# Altium project miniFlycontrol_V6_2.PrjPCB
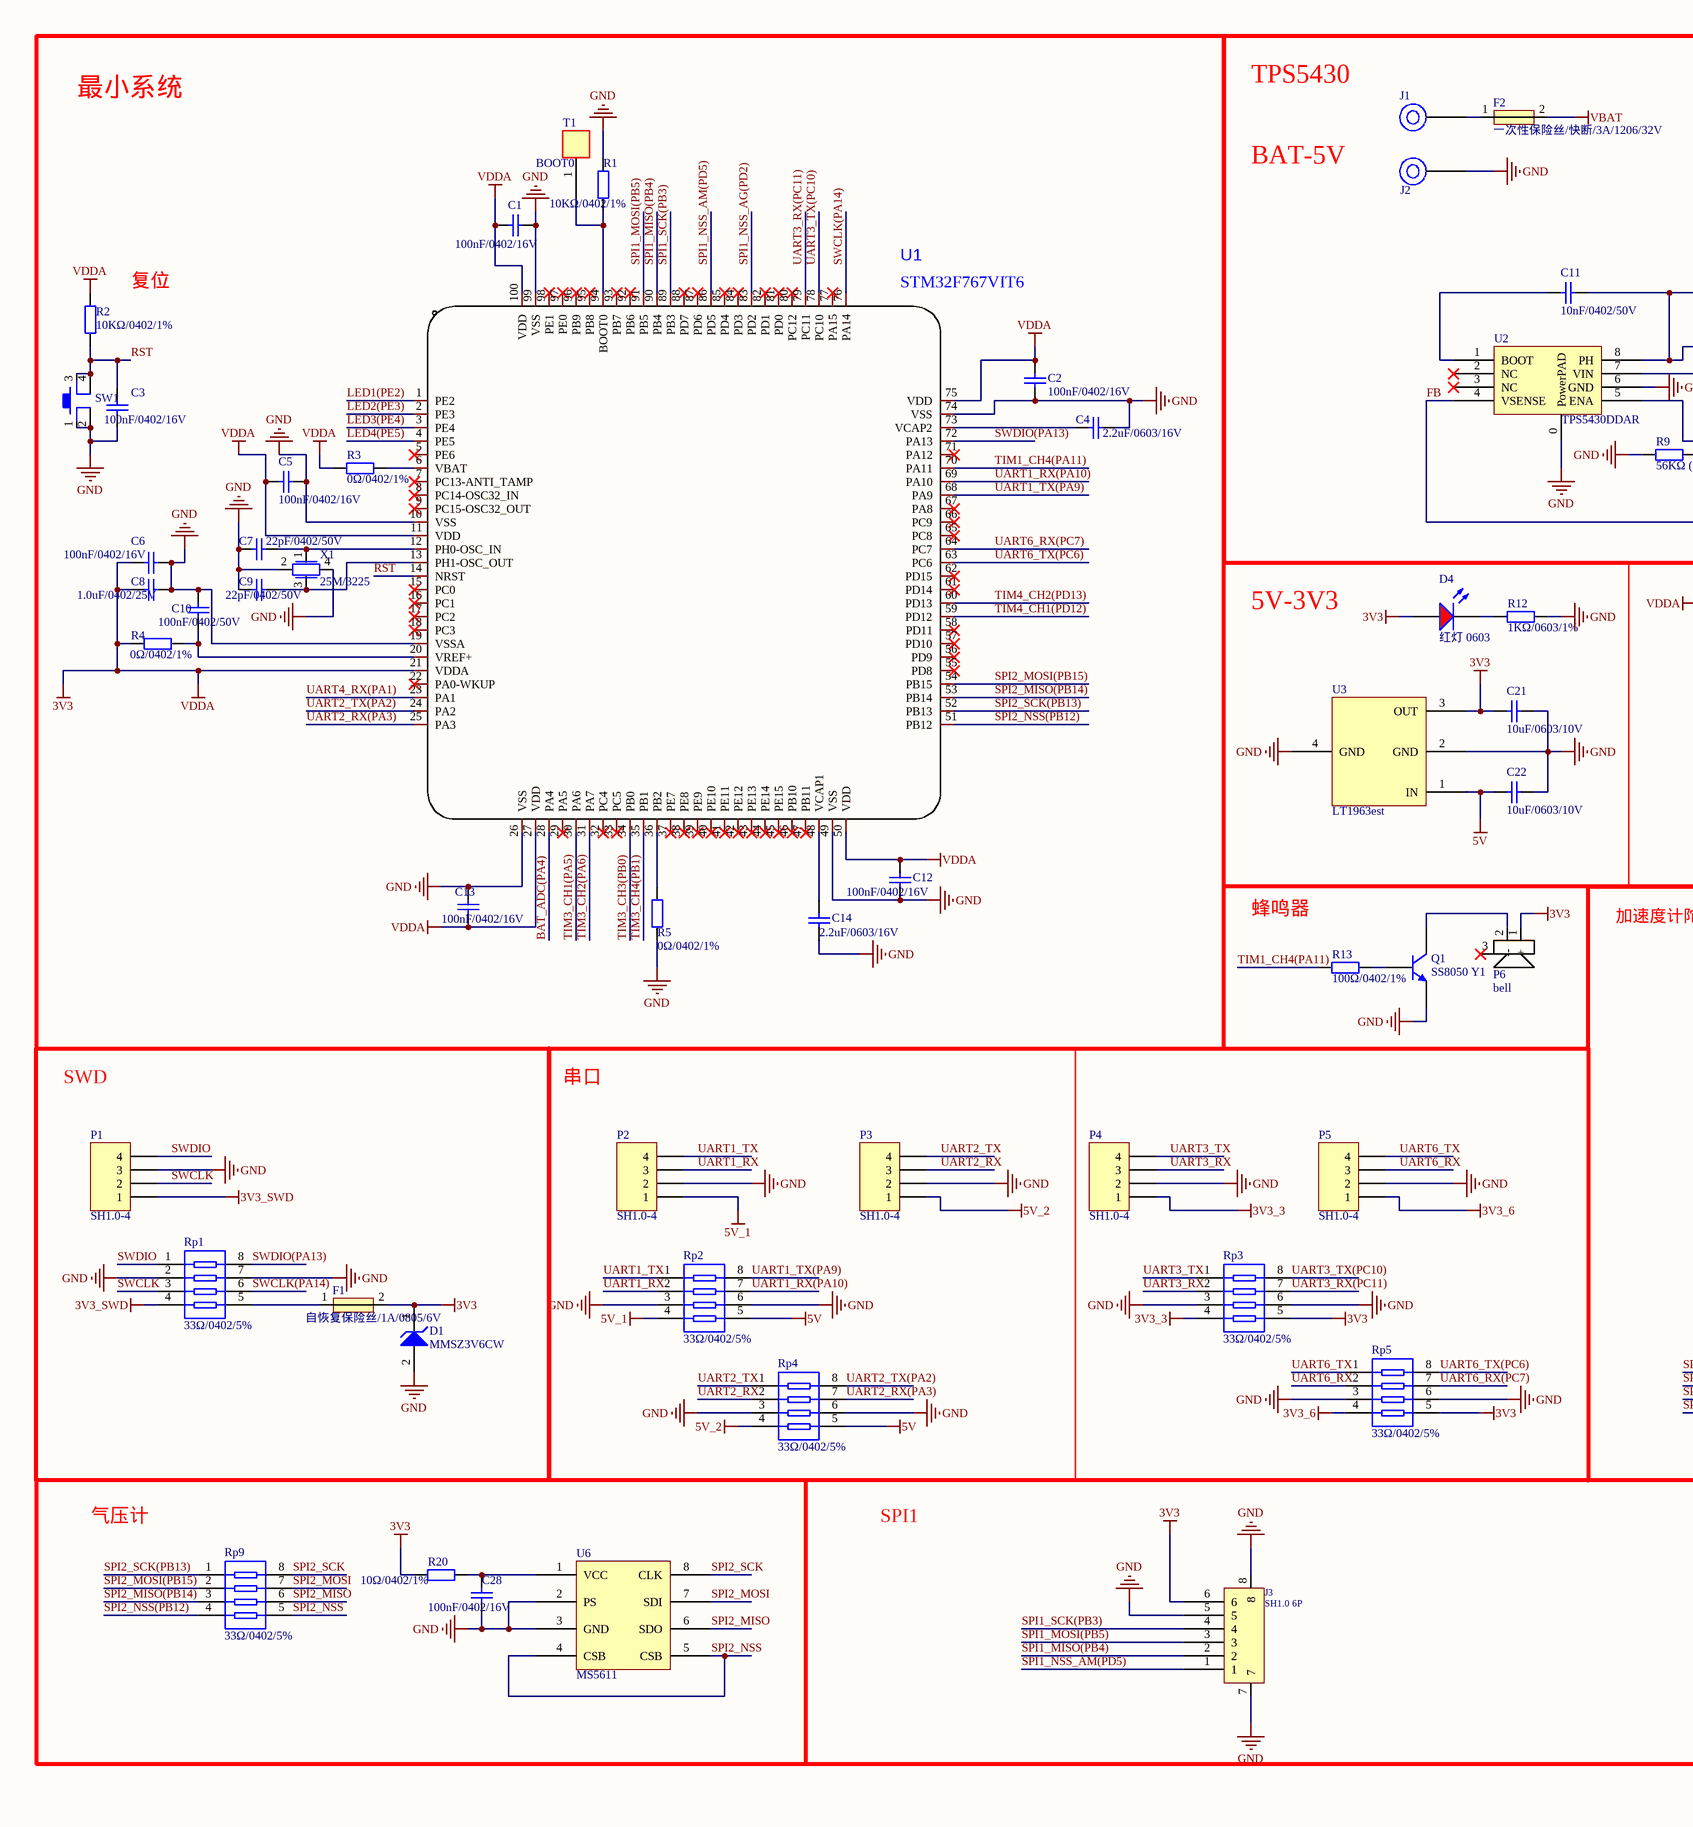
[diagram p0: miniFlycontrol_V6_2.SchDoc, left]
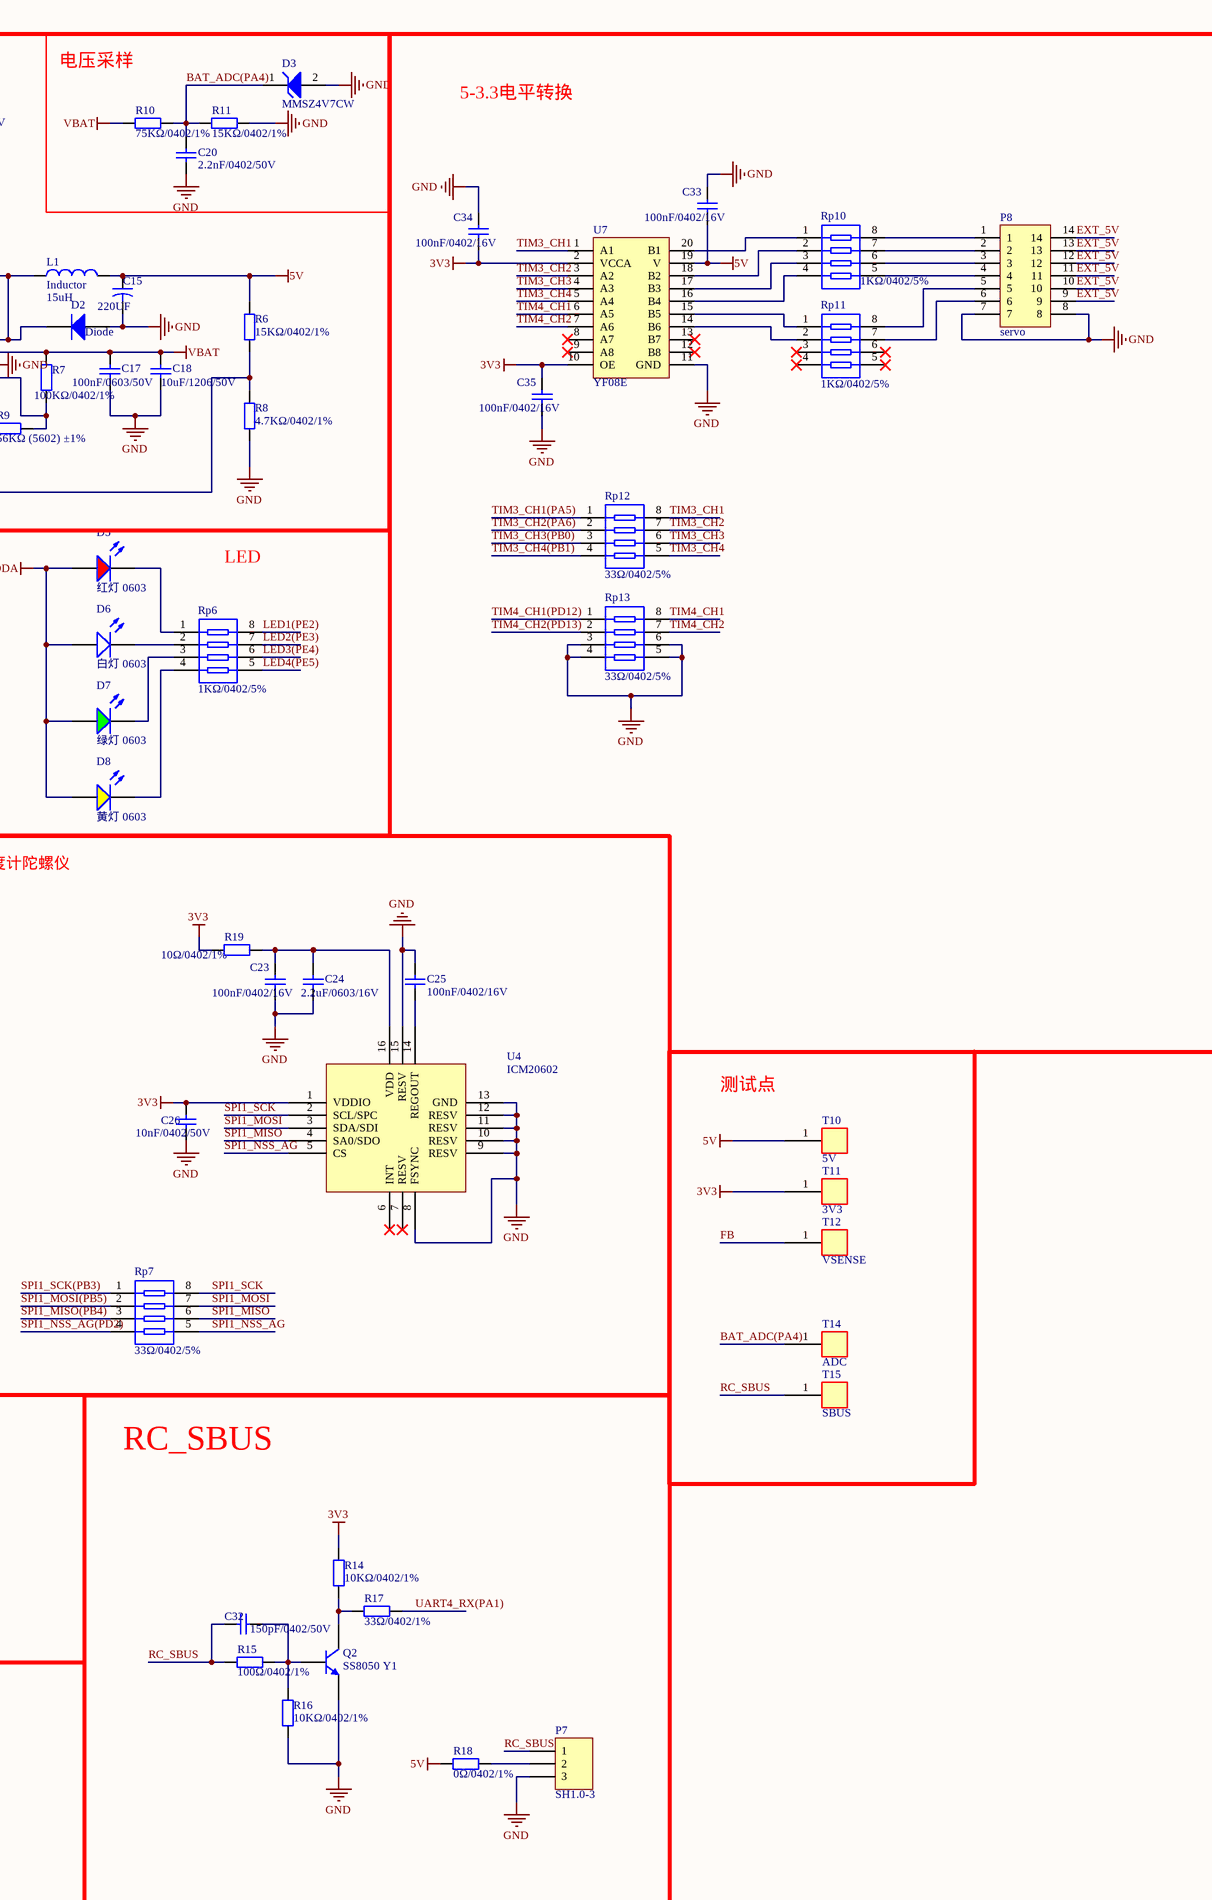
[diagram p1: miniFlycontrol_V6_2.SchDoc, right]
1 sheet, 99 parts. Net scope: global (net labels, ports and power ports of the same name join across sheets).
Board file: miniFlycontrol_V6_2.PcbDoc

## Sheet miniFlycontrol_V6_2.SchDoc
size A2

### Parts
C1  100nF/0402/16V  [0402_C]
C2  100nF/0402/16V  [0402_C]
C3  100nF/0402/16V  [0402_C]
C4  2.2uF/0603/16V  [0603_C]
C5  100nF/0402/16V  [0402_C]
C6  100nF/0402/16V  [0402_C]
C7  22pF/0402/50V  [0402_C]
C8  1.0uF/0402/25V  [0402_C]
C9  22pF/0402/50V  [0402_C]
C10  100nF/0402/50V  [0402_C]
C11  10nF/0402/50V  [0402_C]
C12  100nF/0402/16V  [0402_C]
C13  100nF/0402/16V  [0402_C]
C14  2.2uF/0603/16V  [0603_C]
C15  value 220UF  [钽电容A型3216]  (hidden comment: Cap2)
C17  100nF/0603/50V  [0603_C]
C18  10uF/1206/50V  [1206_C]
C20  2.2nF/0402/50V  [0402_C]
C21  10uF/0603/10V  [0603_C]
C22  10uF/0603/10V  [0603_C]
C23  100nF/0402/16V  [0402_C]
C24  2.2uF/0603/16V  [0603_C]
C25  100nF/0402/16V  [0402_C]
C26  10nF/0402/50V  [0402_C]
C28  100nF/0402/16V  [0402_C]
C32  150pF/0402/50V  [0402_C]
C33  100nF/0402/16V  [0402_C]
C34  100nF/0402/16V  [0402_C]
C35  100nF/0402/16V  [0402_C]
D1  MMSZ3V6CW  [SOD-123]
D2  Diode  [SMA(DO-214AC)]
D3  MMSZ4V7CW  [SOD-123]
D4  红灯 0603  [0603_LED_S1]
D5  红灯 0603  [0603_LED_S1]
D6  白灯 0603  [0603_LED_S1]
D7  绿灯 0603  [0603_LED_S1]
D8  黄灯 0603  [0603_LED_S1]
F1  自恢复保险丝/1A/0805/6V  [0805_R]
F2  一次性保险丝/快断/3A/1206/32V  [1206_R]
J1  接口  [接口]  (value not drawn)
J2  接口  [接口]  (value not drawn)
J3  SH1.0 6P  [SH1.0-6]
L1  Inductor  value 15uH  [功率电感8040]
P1  SH1.0-4  [SH1.0-WS-4P]
P2  SH1.0-4  [SH1.0-WS-4P]
P3  SH1.0-4  [SH1.0-WS-4P]
P4  SH1.0-4  [SH1.0-WS-4P]
P5  SH1.0-4  [SH1.0-WS-4P]
P6  bell  [HY-5030B]
P7  SH1.0-3  [SH1.0-WS-3P]
P8  servo  [servo_6p]
Q1  SS8050 Y1  [SOT-23(SOT-23-3)]
Q2  SS8050 Y1  [SOT-23(SOT-23-3)]
R1  10KΩ/0402/1%  [0402_R]
R2  10KΩ/0402/1%  [0402_R]
R3  0Ω/0402/1%  [0402_R]
R4  0Ω/0402/1%  [0402_R]
R5  0Ω/0402/1%  [0402_R]
R6  15KΩ/0402/1%  [0402_R]
R7  100KΩ/0402/1%  [0402_R]
R8  4.7KΩ/0402/1%  [0402_R]
R9  56KΩ (5602) ±1%  [0402_R]
R10  75KΩ/0402/1%  [0402_R]
R11  15KΩ/0402/1%  [0402_R]
R12  1KΩ/0603/1%  [0603_R]
R13  100Ω/0402/1%  [0402_R]
R14  10KΩ/0402/1%  [0402_R]
R15  100Ω/0402/1%  [0402_R]
R16  10KΩ/0402/1%  [0402_R]
R17  33Ω/0402/1%  [0402_R]
R18  0Ω/0402/1%  [0402_R]
R19  10Ω/0402/1%  [0402_R]
R20  10Ω/0402/1%  [0402_R]
Rp1  33Ω/0402/5%  [0402_Rx4]
Rp2  33Ω/0402/5%  [0402_Rx4]
Rp3  33Ω/0402/5%  [0402_Rx4]
Rp4  33Ω/0402/5%  [0402_Rx4]
Rp5  33Ω/0402/5%  [0402_Rx4]
Rp6  1KΩ/0402/5%  [0402_Rx4]
Rp7  33Ω/0402/5%  [0402_Rx4]
Rp9  33Ω/0402/5%  [0402_Rx4]
Rp10  1KΩ/0402/5%  [0402_Rx4]
Rp11  1KΩ/0402/5%  [0402_Rx4]
Rp12  33Ω/0402/5%  [0402_Rx4]
Rp13  33Ω/0402/5%  [0402_Rx4]
SW1  按键开关  [SW_SMD_4P]  (value not drawn)
T1  BOOT0  [测试点]
T10  5V  [测试点]
T11  3V3  [测试点]
T12  VSENSE  [测试点]
T14  ADC  [测试点]
T15  SBUS  [测试点]
U1  STM32F767VIT6  [STM32F767VIT6]
U2  TPS5430DDAR  [SOP-8_EP_150mil]
U3  LT1963est  [SOT223]
U4  ICM20602  [LGA16]
U6  MS5611  [MS5611-01BA]
U7  YF08E  [VQFN20]
X1  25M/3225  [SMD-3225_4P]

### Blocks framed on the sheet
最小系统: C1-C10 C12-C14 R1-R5 SW1 T1 U1 X1
5-3.3电平转换: C33-C35 P8 Rp10-Rp13 U7
5V-3V3: C21 C22 D4-D8 R12 Rp6 U3
SWD: D1 F1 P1 Rp1
串口: P2-P5 Rp2-Rp5
RC_SBUS: C32 P7 Q2 R14-R18

### Nets
3V3: C1.1 C2.2 C5.1 C6.2 C8.1 C12.2 C13.2 C21.1 C26.2 C34.1 C35.2 D1.1(K) D4.A D5.A D6.A D7.A D8.A F1.2 J3.6 P6.1(+) R2.2 R3.2 R4.1 R14.2 R19.1 R20.1 Rp3.5 Rp5.5 T11.1(VIN) U1.11(VDD) U1.21(VDDA) U1.27(VDD) U1.50(VDD) U1.75(VDD) U1.100(VDD) U3.3(OUT) U4.1(VDDIO) U7.2(VCCA) U7.10(OE)  [also labelled VDDA]
3V3_3: P4.1 Rp3.4
3V3_6: P5.1 Rp5.4
3V3_SWD: P1.1 Rp1.4
5V: C15.1 C22.1 C33.1 L1.2 R6.2 R18.2 Rp2.5 Rp4.5 T10.1(VIN) U3.1(IN) U7.19(V)
5V_1: P2.1 Rp2.4
5V_2: P3.1 Rp4.4
GND: C1.2 C2.1 C3.1 C4.2 C5.2 C6.1 C7.1 C8.2 C9.1 C10.2 C12.1 C13.1 C14.1 C15.2 C17.1 C18.1 C20.1 C21.2 C22.2 C23.1 C24.1 C25.2 C26.1 C28.1 C33.2 C34.2 C35.1 D1.2(A) D2.1(A) D3.2(A) J2.1 J3.5 J3.7 J3.8 P1.3 P2.2 P3.2 P4.2 P5.2 P7.3 P8.7 P8.8 Q1.2(E) Q2.2(E) R1.2 R5.1 R8.1 R9.1 R11.1 R12.2 R16.1 Rp1.2 Rp1.7 Rp2.3 Rp2.6 Rp3.3 Rp3.6 Rp4.3 Rp4.6 Rp5.3 Rp5.6 Rp13.3 Rp13.4 Rp13.5 Rp13.6 SW1.1 SW1.2 U1.10(VSS) U1.19(VSSA) U1.26(VSS) U1.49(VSS) U1.74(VSS) U1.99(VSS) U2.0(PowerPAD) U2.6(GND) U3.2(GND) U3.4(GND) U4.8(FSYNC) U4.9(RESV) U4.10(RESV) U4.11(RESV) U4.12(RESV) U4.13(GND) U4.15(RESV) U6.2(PS) U6.3(GND) U7.11(GND) X1.2(GND) X1.4(GND)
VBAT: C17.2 C18.2 F2.2 R7.2 R10.2 U2.7(VIN)
BAT_ADC(PA4): C20.2 D3.1(K) R10.1 R11.2 T14.1(VIN) U1.28(PA4)
EXT_5V: P8.9 P8.10 P8.11 P8.12 P8.13 P8.14
FB: R6.1 R8.2 T12.1(VIN) U2.4(VSENSE)
LED1(PE2): Rp6.8 U1.1(PE2)
LED2(PE3): Rp6.7 U1.2(PE3)
LED3(PE4): Rp6.6 U1.3(PE4)
LED4(PE5): Rp6.5 U1.4(PE5)
RC_SBUS: C32.1 P7.1 R15.1 T15.1(VIN)
RST: C3.2 R2.1 SW1.3 SW1.4 U1.14(NRST)
SPI1_MISO: Rp7.6 U4.4(SA0/SDO)
SPI1_MISO(PB4): J3.2 Rp7.3 U1.90(PB4)
SPI1_MOSI: Rp7.7 U4.3(SDA/SDI)
SPI1_MOSI(PB5): J3.3 Rp7.2 U1.91(PB5)
SPI1_NSS_AG: Rp7.5 U4.5(CS)
SPI1_NSS_AG(PD2): Rp7.4 U1.83(PD2)
SPI1_NSS_AM(PD5): J3.1 U1.86(PD5)
SPI1_SCK: Rp7.8 U4.2(SCL/SPC)
SPI1_SCK(PB3): J3.4 Rp7.1 U1.89(PB3)
SPI2_MISO: Rp9.6 U6.6(SDO)
SPI2_MISO(PB14): Rp9.3 U1.53(PB14)
SPI2_MOSI: Rp9.7 U6.7(SDI)
SPI2_MOSI(PB15): Rp9.2 U1.54(PB15)
SPI2_NSS: Rp9.5 U6.4(CSB) U6.5(CSB)
SPI2_NSS(PB12): Rp9.4 U1.51(PB12)
SPI2_SCK: Rp9.8 U6.8(CLK)
SPI2_SCK(PB13): Rp9.1 U1.52(PB13)
SWCLK: P1.2 Rp1.3
SWCLK(PA14): Rp1.6 U1.76(PA14)
SWDIO: P1.4 Rp1.1
SWDIO(PA13): Rp1.8 U1.72(PA13)
TIM1_CH4(PA11): R13.1 U1.70(PA11)
TIM3_CH1: Rp12.8 U7.1(A1)
TIM3_CH1(PA5): Rp12.1 U1.30(PA6)
TIM3_CH2: Rp12.7 U7.3(A2)
TIM3_CH2(PA6): Rp12.2 U1.31(PA7)
TIM3_CH3: Rp12.6 U7.4(A3)
TIM3_CH3(PB0): Rp12.3 U1.34(PB0)
TIM3_CH4: Rp12.5 U7.5(A4)
TIM3_CH4(PB1): Rp12.4 U1.35(PB1)
TIM4_CH1: Rp13.8 U7.6(A5)
TIM4_CH1(PD12): Rp13.1 U1.59(PD12)
TIM4_CH2: Rp13.7 U7.7(A6)
TIM4_CH2(PD13): Rp13.2 U1.60(PD13)
UART1_RX: P2.3 Rp2.2
UART1_RX(PA10): Rp2.7 U1.69(PA10)
UART1_TX: P2.4 Rp2.1
UART1_TX(PA9): Rp2.8 U1.68(PA9)
UART2_RX: P3.3 Rp4.2
UART2_RX(PA3): Rp4.7 U1.25(PA3)
UART2_TX: P3.4 Rp4.1
UART2_TX(PA2): Rp4.8 U1.24(PA2)
UART3_RX: P4.3 Rp3.2
UART3_RX(PC11): Rp3.7 U1.79(PC11)
UART3_TX: P4.4 Rp3.1
UART3_TX(PC10): Rp3.8 U1.78(PC10)
UART4_RX(PA1): R17.1 U1.23(PA1)
UART6_RX: P5.3 Rp5.2
UART6_RX(PC7): Rp5.7 U1.64(PC7)
UART6_TX: P5.4 Rp5.1
UART6_TX(PC6): Rp5.8 U1.63(PC6)
NetC4_1: C4.1 U1.73(VCAP2)
NetC7_2: C7.2 U1.12(PH0-OSC_IN) X1.1(OUT)
NetC9_2: C9.2 U1.13(PH1-OSC_OUT) X1.3(OUT)
NetC10_1: C10.1 R4.2 U1.20(VREF+)
NetC11_1: C11.1 U2.1(BOOT)
NetC11_2: C11.2 D2.2(K) L1.1 U2.8(PH)
NetC14_2: C14.2 U1.48(VCAP1)
NetC23_2: C23.2 C24.2 R19.2 U4.16(VDD)
NetC25_1: C25.1 U4.14(REGOUT)
NetC28_2: C28.2 R20.2 U6.1(VCC)
NetC32_2: C32.2 Q2.1(B) R15.2 R16.2
NetD4_K: D4.K R12.1
NetD5_K: D5.K Rp6.1
NetD6_K: D6.K Rp6.2
NetD7_K: D7.K Rp6.3
NetD8_K: D8.K Rp6.4
NetF1_1: F1.1 Rp1.5
NetF2_1: F2.1 J1.1
NetP6_2: P6.2(--) Q1.3(C)
NetP7_2: P7.2 R18.1
NetP8_1: P8.1 Rp10.8
NetP8_2: P8.2 Rp10.7
NetP8_3: P8.3 Rp10.6
NetP8_4: P8.4 Rp10.5
NetP8_5: P8.5 Rp11.8
NetP8_6: P8.6 Rp11.7
NetQ1_1: Q1.1(B) R13.2
NetQ2_3: Q2.3(C) R14.1 R17.2
NetR1_1: R1.1 T1.1(VIN) U1.94(BOOT0)
NetR3_1: R3.1 U1.6(VBAT)
NetR5_2: R5.2 U1.36(PB2)
NetR7_1: R7.1 R9.2 U2.5(ENA)
NetRp10_1: Rp10.1 U7.20(B1)
NetRp10_2: Rp10.2 U7.18(B2)
NetRp10_3: Rp10.3 U7.17(B3)
NetRp10_4: Rp10.4 U7.16(B4)
NetRp11_1: Rp11.1 U7.15(B5)
NetRp11_2: Rp11.2 U7.14(B6)

Not connected (* = marked no-connect by the designer): P6 3*; Rp11 3* 4* 5* 6*; U1 5(PE6)* 7(PC13-ANTI_TAMP)* 8(PC14-OSC32_IN)* 9(PC15-OSC32_OUT)* 15(PC0)* 16(PC1)* 17(PC2)* 18(PC3)* 22(PA0-WKUP)* 29(PA5)* 32(PC4)* 33(PC5)* 37(PE7)* 38(PE8)* 39(PE9)* 40(PE10)* 41(PE11)* 42(PE12)* 43(PE13)* 44(PE14)* 45(PE15)* 46(PB10)* 47(PB11)* 55(PD8)* 56(PD9)* 57(PD10)* 58(PD11)* 61(PD14)* 62(PD15)* 65(PC8)* 66(PC9)* 67(PA8)* 71(PA12)* 77(PA15)* 80(PC12)* 81(PD0)* 82(PD1)* 84(PD3)* 85(PD4)* 87(PD6)* 88(PD7)* 92(PB6)* 93(PB7)* 95(PB8)* 96(PB9)* 97(PE0)* 98(PE1)*; U2 2(NC)* 3(NC)*; U4 6(INT)* 7(RESV)*; U7 8(A7)* 9(A8)* 12(B8)* 13(B7)*

### Notes on the sheet
- TPS5430
- 电压采样
- BAT-5V
- (near R2) 复位
- LED
- 蜂鸣器
- 加速度计陀螺仪
- 测试点
- 气压计
- SPI1

### Library data of the parts
C1-C3 C5 C6 C12 C13 C23 C25 C28 C33-C35 = 0402 100nF (104) 10% 16V: 贴片电容; ComponentLink1Description: 供应商链接; ComponentLink1URL: http://www.szlcsc.com/product/details_1877.html; Package: 0402; Supplier: LC; SuppliersPartNumber: C1525
C4 C14 C24 = 0603 2.2uF (225) 10% 16V: 贴片电容; ComponentLink1Description: 供应商链接; ComponentLink1URL: http://www.szlcsc.com/product/details_24366.html; Package: 0603; Supplier: LC; SuppliersPartNumber: C23630
C7 C9 = 0402 22pF (220) 5% 50V: 贴片电容; ComponentLink1Description: 供应商链接; ComponentLink1URL: http://www.szlcsc.com/product/details_1907.html; Package: 0402; Supplier: LC; SuppliersPartNumber: C1555
C8 = 0402 1.0uF (105) 10% 25V: 贴片电容; ComponentLink1Description: 供应商链接; ComponentLink1URL: http://www.szlcsc.com/product/details_53938.html; Package: 0402; Supplier: LC; SuppliersPartNumber: C52923
C10 C11 C26 = 0402 10nF (103) 10% 50V: 贴片电容; ComponentLink1Description: 供应商链接; ComponentLink1URL: http://www.szlcsc.com/product/details_15869.html; Package: 0402; Supplier: LC; SuppliersPartNumber: C15195
C15 = 220uf/3216: 钽电容; Published: 23-Sep-2002; PackageReference: CAPR5-4X5; Publisher: Altium Limited; PackageDescription: Capacitor; 2 Leads
C17 = 0603 100nF (104) 10% 50V: 贴片电容; ComponentLink1Description: 供应商链接; ComponentLink1URL: http://www.szlcsc.com/product/details_15331.html; Package: 0603; Supplier: LC; SuppliersPartNumber: C14663
C18 = 1206 10uF (106) 10% 50V: 贴片电容; ComponentLink1Description: 供应商链接; ComponentLink1URL: http://www.szlcsc.com/product/details_14236.html; Package: 1206; Supplier: LC; SuppliersPartNumber: C13585
C20 = 0402 2.2nF (222) 10% 50V: 贴片电容; ComponentLink1Description: 供应商链接; ComponentLink1URL: http://www.szlcsc.com/product/details_1883.html; Package: 0402; Supplier: LC; SuppliersPartNumber: C1531
C21 C22 = 0603 10uF (106) 10% 10V: 贴片电容; ComponentLink1Description: 供应商链接; ComponentLink1URL: http://www.szlcsc.com/product/details_20411.html; Package: 0603; Supplier: LC; SuppliersPartNumber: C19702
C32 = 0402 150pF (151) 10% 50V: 贴片电容; ComponentLink1Description: 供应商链接; ComponentLink1URL: http://www.szlcsc.com/product/details_1879.html; Package: 0402; Supplier: LC; SuppliersPartNumber: C1527
D1 D3 = LL-34 ZMM3V3: 稳压二极管; ComponentLink1Description: 供应商链接; ComponentLink1URL: http://www.szlcsc.com/product/details_8535.html; Package: LL-34; Supplier: LC; SuppliersPartNumber: C8056
D2 = SMA: 肖特基; Published: 8-Jun-2000; LatestRevisionDate: 17-Jul-2002; LatestRevisionNote: Re-released for DXP Platform.; PackageVersion: Sep-1996; PackageReference: SMC; Publisher: Altium Limited; PackageDescription: DO-214-AB/SMC; 2 C-Bend Leads; Body 7.9 x 5.9 mm, inc. leads (LxW); Code_JEDEC: DO-214-AB
D4 D5 = 0603 红灯: 发光二极管; ComponentLink1Description: 供应商链接; ComponentLink1URL: http://www.szlcsc.com/product/details_2659.html; Package: 0603; Supplier: LC; SuppliersPartNumber: C2286
D6 = 0603 白灯: 发光二极管; ComponentLink1Description: 供应商链接; ComponentLink1URL: http://www.szlcsc.com/product/details_2663.html; Package: 0603; Supplier: LC; SuppliersPartNumber: C2290
D7 = 0603 绿灯: 发光二极管; ComponentLink1Description: 供应商链接; ComponentLink1URL: http://www.szlcsc.com/product/details_73152.html; Package: 0603; Supplier: LC; SuppliersPartNumber: C72043
D8 = 0603 黄灯: 发光二极管; ComponentLink1Description: 供应商链接; ComponentLink1URL: http://www.szlcsc.com/product/details_73147.html; Package: 0603; Supplier: LC; SuppliersPartNumber: C72038
F1 = FUSE/0805
F2 = FUSE/1206
J3 = SH1.0 6P: 卧式
L1 = 8040/15uH: 电感; Code_IEC: 1005; Published: 8-Jun-2000; LatestRevisionDate: 29-May-2009; LatestRevisionNote: IPC-7351 Footprint Added.; PackageReference: 0402-A; Publisher: Altium Limited; PackageDescription: Chip Inductor; Code_JEITA: 0402
P1-P5 = SH1.0-4: Header, 4-Pin; LatestRevisionDate: 17-Jul-2002; LatestRevisionNote: Re-released for DXP Platform.; Publisher: Altium Limited
P6 = 贴片蜂鸣器
P7 = SH1.0-3: Header, 3-Pin; LatestRevisionDate: 17-Jul-2002; LatestRevisionNote: Re-released for DXP Platform.; Publisher: Altium Limited
P8 = servo_6p
Q1 Q2 = SOT-23 SS8050 Y1: 三极管; ComponentLink1Description: 供应商链接; ComponentLink1URL: http://www.szlcsc.com/product/details_2507.html; Package: SOT-23; Supplier: LC; SuppliersPartNumber: C2150
R1 R2 R14 R16 = 0402 10KΩ (1002) 1%: 贴片电阻; ComponentLink1Description: 供应商链接; ComponentLink1URL: http://www.szlcsc.com/product/details_26487.html; Package: 0402; Supplier: LC; SuppliersPartNumber: C25744
R3-R5 R17 R18 = 0402 0Ω (0R0) 1%: 贴片电阻; ComponentLink1Description: 供应商链接; ComponentLink1URL: http://www.szlcsc.com/product/details_17853.html; Package: 0402; Supplier: LC; SuppliersPartNumber: C17168
R6 R11 = 0402 15KΩ (1502) 1%: 贴片电阻; ComponentLink1Description: 供应商链接; ComponentLink1URL: http://www.szlcsc.com/product/details_26499.html; Package: 0402; Supplier: LC; SuppliersPartNumber: C25756
R7 = 0402 100KΩ (1003) 1%: 贴片电阻; ComponentLink1Description: 供应商链接; ComponentLink1URL: http://www.szlcsc.com/product/details_26484.html; Package: 0402; Supplier: LC; SuppliersPartNumber: C25741
R8 = 0402 4.7KΩ (4701) 1%: 贴片电阻; ComponentLink1Description: 供应商链接; ComponentLink1URL: http://www.szlcsc.com/product/details_26643.html; Package: 0402; Supplier: LC; SuppliersPartNumber: C25900
R9 = 0402 56KΩ (5602) 1%: 贴片电阻; ComponentLink1Description: 供应商链接; ComponentLink1URL: http://www.szlcsc.com/product/details_26539.html; Package: 0402; Supplier: LC; SuppliersPartNumber: C25796
R10 = 0402 75KΩ (7502) 1%: 贴片电阻; ComponentLink1Description: 供应商链接; ComponentLink1URL: http://www.szlcsc.com/product/details_26541.html; Package: 0402; Supplier: LC; SuppliersPartNumber: C25798
R12 = 0603 2.2KΩ (2201) 1%: 贴片电阻; ComponentLink1Description: 供应商链接; ComponentLink1URL: http://www.szlcsc.com/product/details_4597.html; Package: 0603; Supplier: LC; SuppliersPartNumber: C4190
R13 R15 = 0402 100Ω (1000) 1%: 贴片电阻; ComponentLink1Description: 供应商链接; ComponentLink1URL: http://www.szlcsc.com/product/details_25819.html; Package: 0402; Supplier: LC; SuppliersPartNumber: C25076
R19 R20 = 0402 10Ω (10R0) 1%: 贴片电阻; ComponentLink1Description: 供应商链接; ComponentLink1URL: http://www.szlcsc.com/product/details_25820.html; Package: 0402; Supplier: LC; SuppliersPartNumber: C25077
Rp1-Rp7 Rp9-Rp13 = 0402*4 1KΩ (102) 5%_1: 贴片排阻; ComponentLink1Description: 供应商链接; ComponentLink1URL: http://www.szlcsc.com/product/details_26469.html; Package: 0402*4; Supplier: LC; SuppliersPartNumber: C25726
SW1 = SW_SMD_4P
T1 T10-T12 T14 T15 = 测试点
U1 = STM32F767VIT6: Manufacturer: ST(意法半导体); Add into BOM: yes; Core Processor: ARM® Cortex®-M7; Speed: 216MHz; Voltage - Supply (Vcc/Vdd): 1.7V ~ 3.6V; Program Memory Size: 2MB; RAM Size: 512KB; Number of I/O: 82; A/D: 16x12bit; D/A: 2x12bit; PWM: 60; LCD: LCD TFT Controller up to 1024x728; UART/USART: 4 USART+4 UART; SPI: 4; USB Device: 1; CAN: 3; Ethernet: 10/100 Ethernet MAC; Name: STM32F767VIT6; Symbol: STM32F767VIT6; Device: STM32F767VIT6; LCSC Part Name: STM32F767VIT6; Supplier Part: C91934; Manufacturer Part: STM32F767VIT6; Supplier Footprint: LQFP-100_14x14x05P; JLCPCB Part Class: Extended Part; Datasheet: https://atta.szlcsc.com/upload/public/pdf/source/20170712/C91934_1499832486915814733.pdf; Supplier: LCSC; Convert to PCB: yes; I2C（SMBUS/PMBUS）: 4; USB Host/OTG: 1; Features: I2S,HDMI CEC,S/PDIF,SAI
U2 = TPS5430DDAR_[C9864]: DC-DC芯片; Notepad: 0 pin:        GND pin must be connected to the exposed pad for proper operation.; ComponentLink1Description: 供应商链接; ComponentLink1URL: http://www.szlcsc.com/product/details_10396.html; Package: SOP-8_EP_150mil; Supplier: LC; SuppliersPartNumber: C9864
U7 = TXS0108
X1 = XTAL_4